# Altium schematic sheet SCH_PLC.SchDoc
size A4; SheetNumber: 1; SheetTotal: 9
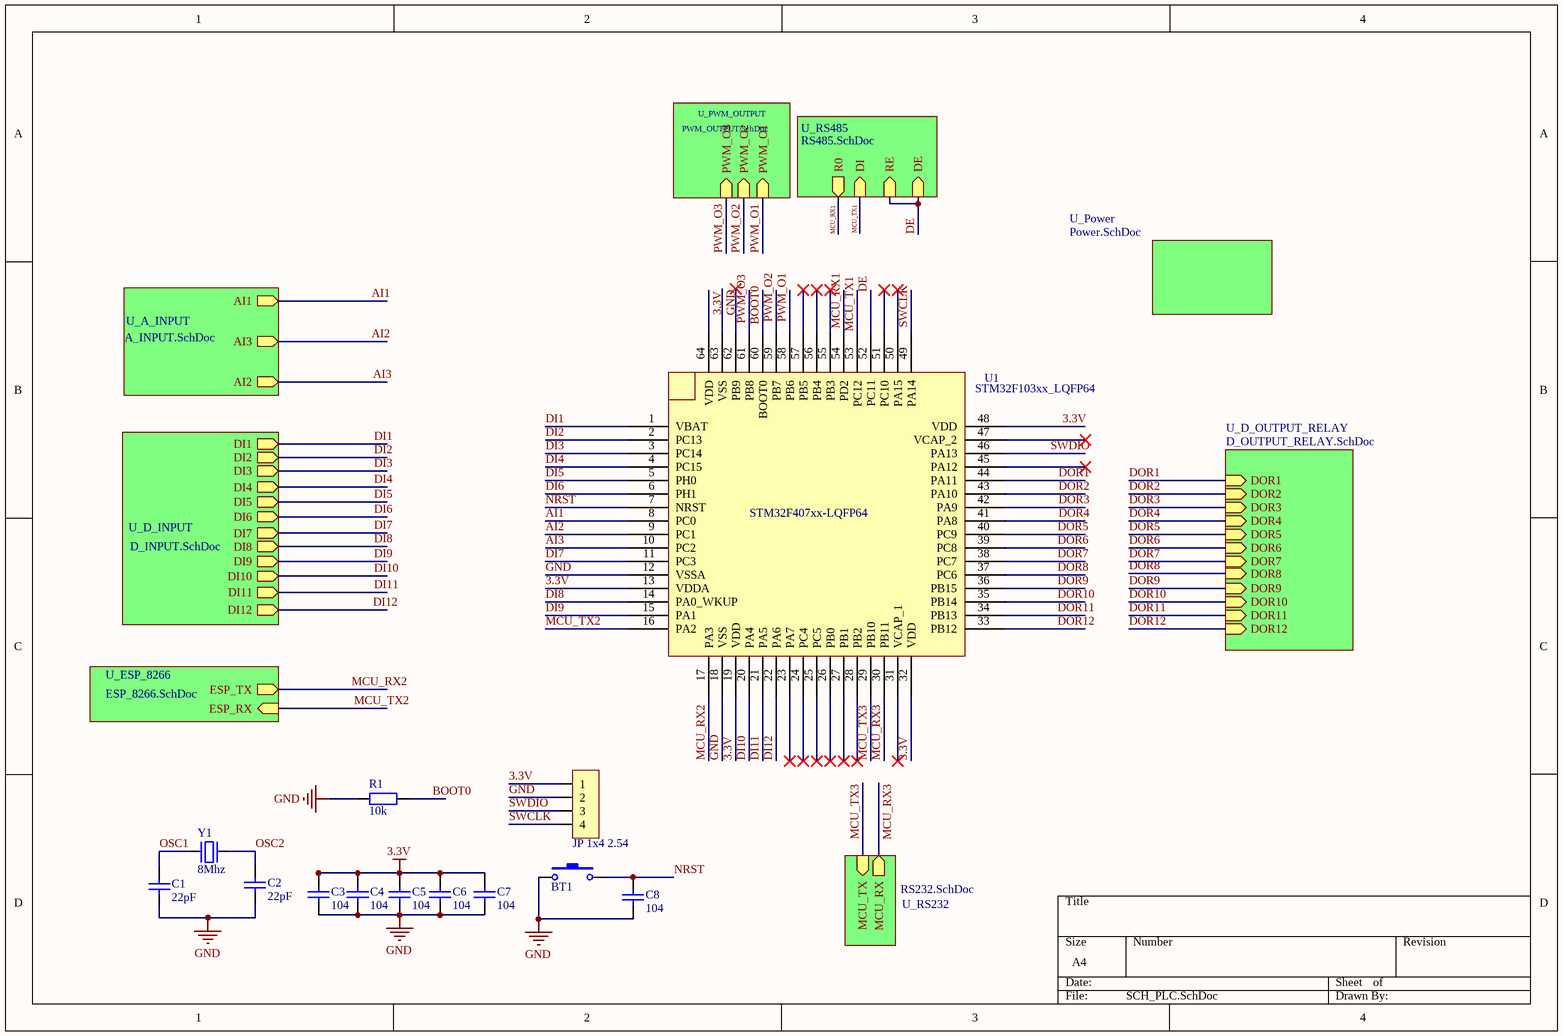
[diagram p0: SCH_PLC.SchDoc]

## Parts
BT1  Nut Nhan 2 Chan SMD 3x6x2.5  [Nut Nhan 2 Chan SMD 3x6x2.5]  (value not drawn)
C1  22pF  [tu 0805]
C2  22pF  [tu 0805]
C3  104  [tu 0805]
C4  104  [tu 0805]
C5  104  [tu 0805]
C6  104  [tu 0805]
C7  104  [tu 0805]
C8  104  [tu 0805]
JP1  JP 1x4 2.54  [JP 1x4 DT]
R1  10k  [tro smd 0805]
U1  STM32F103xx_LQFP64  [STM32_LQFP64]
Y1  8Mhz  [Thach Anh 2 chan SMD]

## Sub-sheets
U_A_INPUT = A_INPUT.SchDoc: AI1 (out), AI3 (out), AI2 (out)
U_D_INPUT = D_INPUT.SchDoc: DI7 (out), DI2 (out), DI12 (out), DI3 (out), DI10 (out), DI8 (out), DI11 (out), DI9 (out), DI6 (out), DI1 (out), DI5 (out), DI4 (out)
U_D_OUTPUT_RELAY = D_OUTPUT_RELAY.SchDoc: DOR6 (in), DOR8 (in), DOR12 (in), DOR11 (in), DOR5 (in), DOR4 (in), DOR3 (in), DOR1 (in), DOR7 (in), DOR2 (in), DOR9 (in), DOR10 (in)
U_ESP_8266 = ESP_8266.SchDoc: ESP_TX (out), ESP_RX (in)
U_Power = Power.SchDoc: no entries
U_PWM_OUTPUT = PWM_OUTPUT.SchDoc: PWM_O3 (in), PWM_O1 (in), PWM_O2 (in)
U_RS232 = RS232.SchDoc: MCU_RX (out), MCU_TX (in)
U_RS485 = RS485.SchDoc: RE (in), DE (in), DI (in), R0 (out)

## Nets
3.3V: C3.1 C4.1 C5.1 C6.2 C7.2 JP1.1 U1.13(VDDA) U1.19(VDD) U1.32(VDD) U1.48(VDD) U1.64(VDD)
GND: BT1.1 C1.2 C2.2 C3.2 C4.2 C5.2 C6.1 C7.1 C8.1 JP1.2 R1.1 U1.12(VSSA) U1.18(VSS) U1.63(VSS)
AI1: U1.8(PC0) ; sheet U_A_INPUT/AI1
AI2: U1.9(PC1) ; sheet U_A_INPUT/AI3
AI3: U1.10(PC2) ; sheet U_A_INPUT/AI2
BOOT0: R1.2 U1.60(BOOT0)
DE: U1.52(PC11) ; sheet U_RS485/RE, sheet U_RS485/DE
DI1: U1.1(VBAT) ; sheet U_D_INPUT/DI1
DI2: U1.2(PC13) ; sheet U_D_INPUT/DI2
DI3: U1.3(PC14) ; sheet U_D_INPUT/DI3
DI4: U1.4(PC15) ; sheet U_D_INPUT/DI4
DI5: U1.5(PH0) ; sheet U_D_INPUT/DI5
DI6: U1.6(PH1) ; sheet U_D_INPUT/DI6
DI7: U1.11(PC3) ; sheet U_D_INPUT/DI7
DI8: U1.14(PA0_WKUP) ; sheet U_D_INPUT/DI8
DI9: U1.15(PA1) ; sheet U_D_INPUT/DI9
DI10: U1.20(PA4) ; sheet U_D_INPUT/DI10
DI11: U1.21(PA5) ; sheet U_D_INPUT/DI11
DI12: U1.22(PA6) ; sheet U_D_INPUT/DI12
DOR1: U1.44(PA11) ; sheet U_D_OUTPUT_RELAY/DOR1
DOR2: U1.43(PA10) ; sheet U_D_OUTPUT_RELAY/DOR2
DOR3: U1.42(PA9) ; sheet U_D_OUTPUT_RELAY/DOR3
DOR4: U1.41(PA8) ; sheet U_D_OUTPUT_RELAY/DOR4
DOR5: U1.40(PC9) ; sheet U_D_OUTPUT_RELAY/DOR5
DOR6: U1.39(PC8) ; sheet U_D_OUTPUT_RELAY/DOR6
DOR7: U1.38(PC7) ; sheet U_D_OUTPUT_RELAY/DOR7
DOR8: U1.37(PC6) ; sheet U_D_OUTPUT_RELAY/DOR8
DOR9: U1.36(PB15) ; sheet U_D_OUTPUT_RELAY/DOR9
DOR10: U1.35(PB14) ; sheet U_D_OUTPUT_RELAY/DOR10
DOR11: U1.34(PB13) ; sheet U_D_OUTPUT_RELAY/DOR11
DOR12: U1.33(PB12) ; sheet U_D_OUTPUT_RELAY/DOR12
MCU_RX1: U1.54(PD2) ; sheet U_RS485/R0
MCU_RX2: U1.17(PA3) ; sheet U_ESP_8266/ESP_TX
MCU_RX3: U1.30(PB11) ; sheet U_RS232/MCU_RX
MCU_TX1: U1.53(PC12) ; sheet U_RS485/DI
MCU_TX2: U1.16(PA2) ; sheet U_ESP_8266/ESP_RX
MCU_TX3: U1.29(PB10) ; sheet U_RS232/MCU_TX
NRST: BT1.2 C8.2 U1.7(NRST)
OSC1: C1.1 Y1.1
OSC2: C2.1 Y1.2
PWM_O1: U1.58(PB6) ; sheet U_PWM_OUTPUT/PWM_O1
PWM_O2: U1.59(PB7) ; sheet U_PWM_OUTPUT/PWM_O2
PWM_O3: U1.61(PB8) ; sheet U_PWM_OUTPUT/PWM_O3
SWCLK: JP1.4 U1.49(PA14)
SWDIO: JP1.3 U1.46(PA13)

Not connected (* = marked no-connect by the designer): U1 23(PA7)* 24(PC4)* 25(PC5)* 26(PB0)* 27(PB1)* 28(PB2)* 31(VCAP_1)* 45(PA12)* 47(VCAP_2)* 50(PA15)* 51(PC10)* 55(PB3)* 56(PB4)* 57(PB5)* 62(PB9)*

## Notes on the sheet
- (in symbol STM32F103xx_LQFP64) STM32F407xx-LQFP64

## Library data of the parts
BT1 = Nut Nhan 2 Chan SMD 3x6x2.5: Ma_Hang: MH001036; Ten: Nút Nhấn 2 Chân 3x6x2.5MM SMD
C1 C2 = Tu 0805 22pF 50V 10%: Dán; Don_Vi: Con; So_Chan: 2; Ten_Linh_Kien: Tụ 0805 22P 10% 50V; Ma_Hang: MH004560; Chung_Loai: Dán; Kieu_Chan: *
C3-C8 = Tu 0805 104 50V 10%: Dán; Don_Vi: Con; So_Chan: 2; Ten_Linh_Kien: Tụ 0805 104-100nF 10% 50V; Ma_Hang: MH004551; Chung_Loai: Dán; Kieu_Chan: *
JP1 = JP 1x4 2.54 Duc Thang: Cắm; Ten_Linh_Kien: Jump Đơn Đực 2.54MM 1x40P Thẳng 11MM; Don_Vi: Con; Ma_Hang: MH000903; Ghi_Chu: *; Kieu_Chan: *; Chung_Loai: Cắm
R1 = Tro 0805 1% 10k: Dán; Don_Vi: Con; So_Chan: 2; Ten_Linh_Kien: Trở 0805 1% 10k; Ma_Hang: MH005473; Chung_Loai: Dán; Kieu_Chan: *
Y1 = Thach Anh 2 chan SMD: Crystal For all Crystal 2pin.; Value: 4Mhz